# Altium schematic sheet gtx45r.SchDoc
size A; SheetNumber: 12; SheetTotal: 17
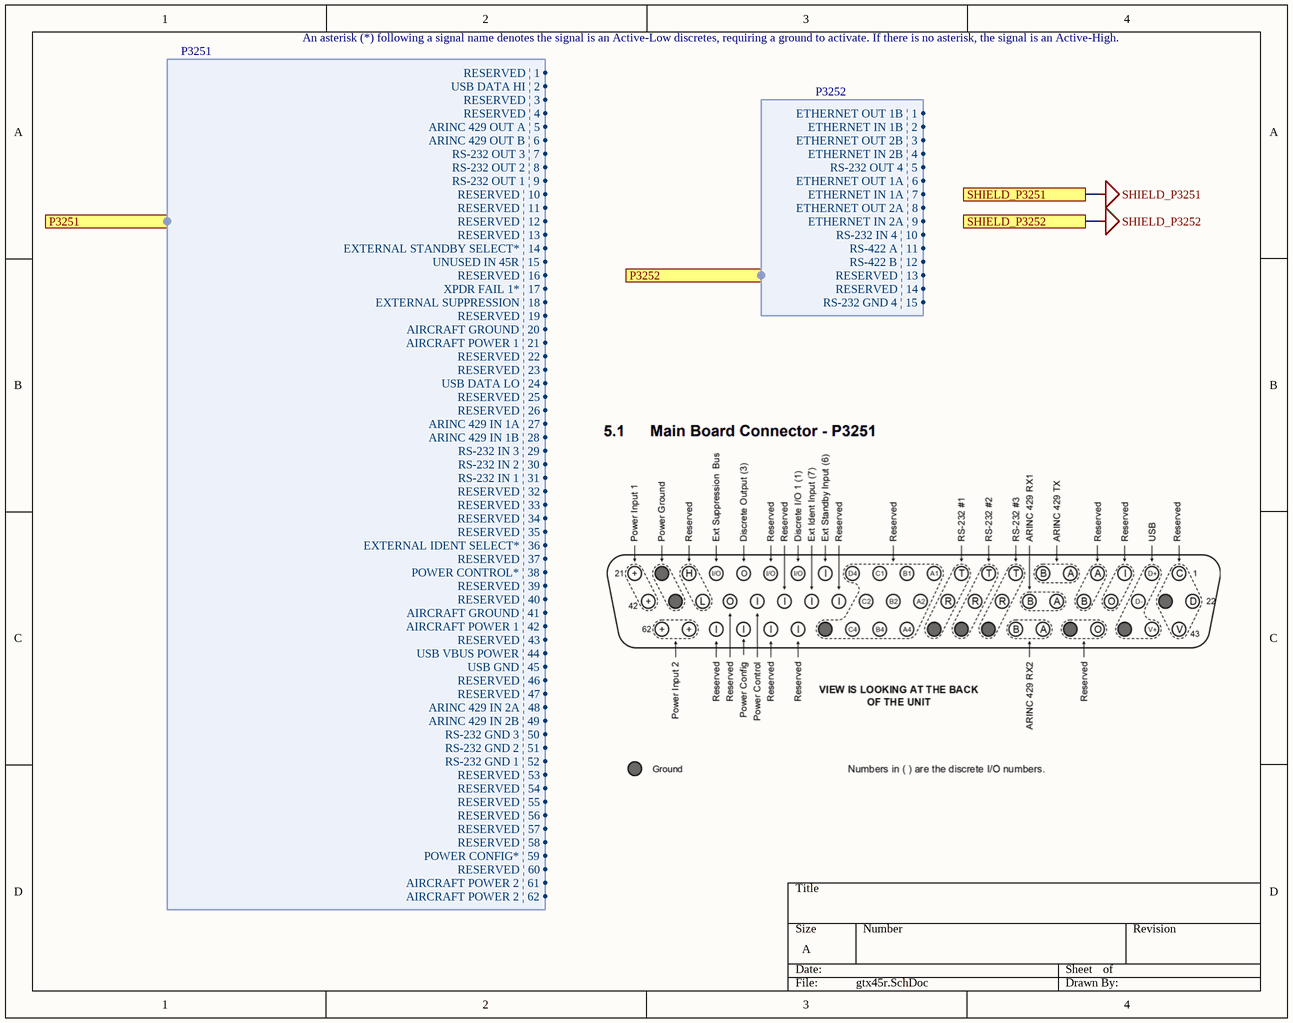
[diagram p0: gtx45r.SchDoc]

## Ports
P3251 (harness P3251), P3252 (harness P3252), SHIELD_P3251, SHIELD_P3252

## Harnesses
P3251: RESERVED | 1, USB DATA HI | 2, RESERVED | 3, RESERVED | 4, ARINC 429 OUT A | 5, ARINC 429 OUT B | 6, RS-232 OUT 3 | 7, RS-232 OUT 2 | 8, RS-232 OUT 1 | 9, RESERVED | 10, RESERVED | 11, RESERVED | 12, RESERVED | 13, EXTERNAL STANDBY SELECT* | 14, UNUSED IN 45R | 15, RESERVED | 16, XPDR FAIL 1* | 17, EXTERNAL SUPPRESSION | 18, RESERVED | 19, AIRCRAFT GROUND | 20, AIRCRAFT POWER 1 | 21, RESERVED | 22, RESERVED | 23, USB DATA LO | 24, RESERVED | 25, RESERVED | 26, ARINC 429 IN 1A | 27, ARINC 429 IN 1B | 28, RS-232 IN 3 | 29, RS-232 IN 2 | 30, RS-232 IN 1 | 31, RESERVED | 32, RESERVED | 33, RESERVED | 34, RESERVED | 35, EXTERNAL IDENT SELECT* | 36, RESERVED | 37, POWER CONTROL* | 38, RESERVED | 39, RESERVED | 40, AIRCRAFT GROUND | 41, AIRCRAFT POWER 1 | 42, AIRCRAFT POWER 2 | 62, RESERVED | 43, USB VBUS POWER | 44, USB GND | 45, RESERVED | 46, RESERVED | 47, ARINC 429 IN 2A | 48, ARINC 429 IN 2B | 49, RS-232 GND 3 | 50, RS-232 GND 2 | 51, RS-232 GND 1 | 52, RESERVED | 53, RESERVED | 54, RESERVED | 55, RESERVED | 56, RESERVED | 57, RESERVED | 58, POWER CONFIG* | 59, RESERVED | 60, AIRCRAFT POWER 2 | 61
P3252: ETHERNET OUT 1B | 1, ETHERNET IN 1B | 2, ETHERNET OUT 2B | 3, ETHERNET IN 2B | 4, RS-232 OUT 4 | 5, ETHERNET OUT 1A | 6, ETHERNET IN 1A | 7, ETHERNET OUT 2A | 8, ETHERNET IN 2A | 9, RS-232 IN 4 | 10, RS-422 A | 11, RS-422 B | 12, RESERVED | 13, RESERVED | 14, RS-232 GND 4 | 15

## Nets
SHIELD_P3251: port SHIELD_P3251
SHIELD_P3252: port SHIELD_P3252

## Notes on the sheet
- An asterisk (*) following a signal name denotes the signal is an Active-Low discretes, requiring a ground to activate. If there is no asterisk, the signal is an Active-High.